# Altium schematic sheet Choin_main1_0.SchDoc
size A4; DocumentNumber: 1; SheetNumber: 1; SheetTotal: 4; LotOfPieces: 1
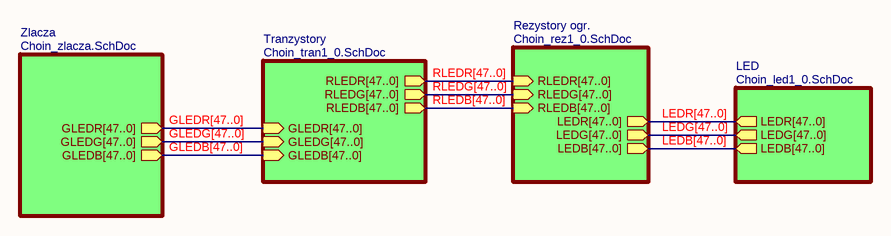
[diagram p0: Choin_main1_0.SchDoc]

## Sub-sheets
LED = Choin_led1_0.SchDoc: LEDR[47..0], LEDG[47..0], LEDB[47..0]
Rezystory ogr. = Choin_rez1_0.SchDoc: LEDR[47..0], LEDG[47..0], LEDB[47..0], RLEDR[47..0], RLEDG[47..0], RLEDB[47..0]
Tranzystory = Choin_tran1_0.SchDoc: RLEDR[47..0], RLEDG[47..0], RLEDB[47..0], GLEDR[47..0], GLEDG[47..0], GLEDB[47..0]
Zlacza = Choin_zlacza.SchDoc: GLEDR[47..0], GLEDG[47..0], GLEDB[47..0]

## Buses and harness runs
bus GLEDB[47..0] = sheet Tranzystory/GLEDB[47..0] = sheet Zlacza/GLEDB[47..0]
bus GLEDG[47..0] = sheet Tranzystory/GLEDG[47..0] = sheet Zlacza/GLEDG[47..0]
bus GLEDR[47..0] = sheet Tranzystory/GLEDR[47..0] = sheet Zlacza/GLEDR[47..0]
bus LEDB[47..0] = sheet LED/LEDB[47..0] = sheet Rezystory ogr./LEDB[47..0]
bus LEDG[47..0] = sheet LED/LEDG[47..0] = sheet Rezystory ogr./LEDG[47..0]
bus LEDR[47..0] = sheet LED/LEDR[47..0] = sheet Rezystory ogr./LEDR[47..0]
bus RLEDB[47..0] = sheet Rezystory ogr./RLEDB[47..0] = sheet Tranzystory/RLEDB[47..0]
bus RLEDG[47..0] = sheet Rezystory ogr./RLEDG[47..0] = sheet Tranzystory/RLEDG[47..0]
bus RLEDR[47..0] = sheet Rezystory ogr./RLEDR[47..0] = sheet Tranzystory/RLEDR[47..0]

## Notes on the sheet
- Projekt i wykonanie: (C) Miroslaw Lach MRQ, www.mrq-ml.com
- SVNPath:
- Page:
- Rev.
- /
- Plik: